# Altium schematic sheet 6_BATT+5V.SchDoc
size A4; SheetNumber: 7; SheetTotal: 12
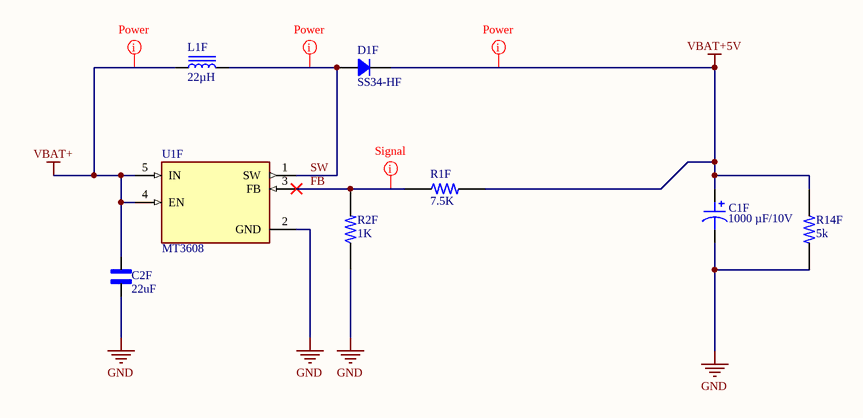
[diagram p0: 6_BATT+5V.SchDoc]

## Parts
C1F  1000 µF/10V  [CAP AL TH D8 L3.5 H12.5]
C2F  22uF  [C-0603]
D1F  SS34-HF  [DO214AC SMA]
L1F  22µH  [TDK SLF7032]
R1F  7.5K  [R-0603]
R2F  1K  [R-0603]
R14F  5k  [R-0603]
U1F  MT3608  [MT3608-SOT23]

## Nets
GND: C1F.2 C2F.1 R2F.1 R14F.2 U1F.2(GND)
VBAT+: C2F.2 L1F.1 U1F.4(EN) U1F.5(IN)
VBAT+5V: C1F.1 D1F.2 R1F.2 R14F.1
FB: R1F.1 R2F.2 U1F.3(FB)
SW: D1F.1 L1F.2 U1F.1(SW)

## Layout directives
net class Power: VBAT+
net class Power; rule Supply Nets [Voltage = 0.000]: SW, VBAT+5V
net class Signal: FB

## Library data of the parts
C1F = ECA-0JHG102: CAP ALUM 1000UF 20% 6.3V RADIAL; manufacturer: Panasonic Electronic Components; Capacitance: 1000 µF; Lifetime @ Temp.: 1000 Hrs @ 105°C; Polarization: Polar; Ripple Current @ High Frequency: 437 mA @ 100 kHz; Ripple Current @ Low Frequency: 380 mA @ 120 Hz; Part Number: ECA-0JHG102; Applications: General Purpose; componentlink1description: Datasheet; componentlink1url: https://industrial.panasonic.com/cdbs/www-data/pdf/RDF0000/ABA0000C75.pdf; componentlink2description: DigiKey Link; componentlink2url: https://www.digikey.com/en/products/detail/panasonic-electronic-components/ECA-0JHG102/245108; Device Package: Radial, Can; Height - Seated (Max): 0.492" (12.50mm); lastupdated: 27-12-2022 10:20:14 PM; Lead Spacing: 0.138" (3.50mm); Lifecycle Status: Active; Minimum Order: 1; Mounting Type: Through Hole; Operating Temperature: -55°C ~ 105°C; Package / Case: Radial, Can; packaging: Bulk; partid: 7190; Part Status: Active; price: 0.15; series: NHG-A; Size / Dimension: 0.315" Dia (8.00mm); Supplier 1: DigiKey; Supplier Part Number 1: P5509-ND; Tolerance: ±20%; value: 1000 µF/10V; Voltage - Rated: 6.3 V
C2F = C-0603: Ceramic Capacitor 16V 0603 (1608 Metric); MP: C0603C104J4RAC; MF: KEMET; SnapEDA_Link: https://www.snapeda.com/parts/C0603C104J4RAC/KEMET/view-part/1763758/?ref=snap; Availability: Warning; Package: 0603 KEMET; Check_prices: https://www.snapeda.com/parts/C0603C104J4RAC/KEMET/view-part/1763758/?ref=eda; Value: *; Price: None
D1F = SS34-HF: DIODE SCHOTTKY 40V 3A DO214AC; Manufacturer: Comchip Technology; Capacitance @ Vr, F: 450pF @ 4V, 1MHz; Current - Reverse Leakage @ Vr: 500 µA @ 40 V; Speed: Fast Recovery =< 500ns, > 200mA (Io); Voltage - Forward (Vf) (Max) @ If: 550 mV @ 3 A; Part Number: SS34-HF; ComponentLink2Description: DigiKey Link; ComponentLink2URL: https://www.digikey.com/en/products/detail/comchip-technology/SS34-HF/10279693; Current - Average Rectified (Io): 3A; Diode Type: Schottky; LastUpdated: 01-01-2023 08:55:34 PM; Lifecycle Status: Active; Minimum Order: 1; Mounting Type: Surface Mount; Package / Case: DO-214AC, SMA; Packaging: TapeAndReel; PartId: 2138; Price: 0.07; Supplier 1: DigiKey; Supplier Part Number 1: 641-2115-1-ND; Supplier Device Package: DO-214AC (SMA); Voltage - DC Reverse (Vr) (Max): 40 V; ComponentLink1Description: Datasheet; ComponentLink1URL: http://www.comchiptech.com/admin/files/product/20190514101641.pdf; Operating Temperature - Junction: -55°C ~ 125°C; Part Status: Active; Series: -
L1F = SLF7032T-220MR96-2PF: FIXED IND 22UH 960MA 132 MOHM; Manufacturer: TDK Corporation; DC Resistance (DCR): 132mOhm Max; Inductance Frequency - Test: 100kHz; Material - Core: Ferrite; Shielding: Shielded; Tolerance: ±20%; Type: Wirewound; Part Number: SLF7032T-220MR96-2PF; ComponentLink1Description: Datasheet; ComponentLink1URL: //media.digikey.com/pdf/Data%20Sheets/TDK%20PDFs/SLF7032_Type.pdf; ComponentLink2Description: DigiKey Link; ComponentLink2URL: http://digikey.com/product-detail/en/tdk-corporation/SLF7032T-220MR96-2PF/445-2003-1-ND/755410; Current Rating (Amps): 960mA; Device Package: Nonstandard; Height - Seated (Max): 0.134" (3.40mm); Inductance: 22µH; LastUpdated: 02-09-2020 01:30:24; Lifecycle Status: Active; Minimum Order: 1; Mounting Type: Surface Mount; Operating Temperature: -40°C ~ 105°C; Package / Case: Nonstandard; Packaging: TapeAndReel; PartId: 3680; Part Status: Active; Price: 0.43; Series: SLF; Size / Dimension: 0.276" L x 0.276" W (7.00mm x 7.00mm); Supplier 1: DigiKey; Supplier Part Number 1: 445-2003-1-ND; Value: 22µH
R1F R2F R14F = R-0603: 0603; MP: 2-1623703-0; Power_Rating: .1 W; Value: 10K; Tolerance: 1%; MF: TE Connectivity; Package: 0603; Price: None; Resistance: 10K; Check_prices: https://www.snapeda.com/parts/2-1623703-0/TE%20Connectivity/view-part/2213192/?ref=eda; SnapEDA_Link: https://www.snapeda.com/parts/2-1623703-0/TE%20Connectivity/view-part/2213192/?ref=snap; Availability: Warning
U1F = MT3608: High Efficiency 1.2MHz 2A Step Up Converter; Value: *; Availability: Unavailable; Price: None; Package: None; MP: MT3608